# EAGLE design DIYmakey_v2 (EAGLE 9.6.2)
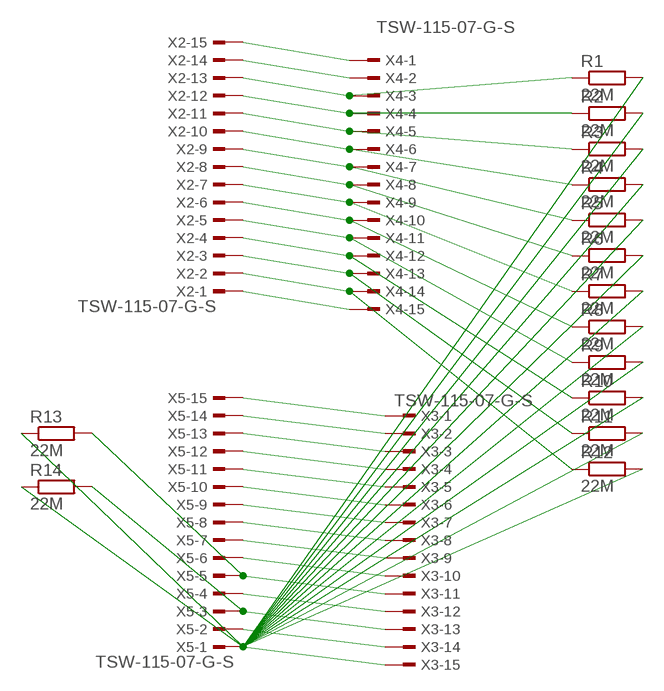
[diagram p0: schematic, sheet 1]

## Parts
R1  22M  R-EU_0207/7  [0207/7]
R2  22M  R-EU_0207/7  [0207/7]
R3  22M  R-EU_0207/7  [0207/7]
R4  22M  R-EU_0207/7  [0207/7]
R5  22M  R-EU_0207/7  [0207/7]
R6  22M  R-EU_0207/7  [0207/7]
R7  22M  R-EU_0207/7  [0207/7]
R8  22M  R-EU_0207/7  [0207/7]
R9  22M  R-EU_0207/7  [0207/7]
R10  22M  R-EU_0207/7  [0207/7]
R11  22M  R-EU_0207/7  [0207/7]
R12  22M  R-EU_0207/7  [0207/7]
R13  22M  R-EU_0207/7  [0207/7]
R14  22M  R-EU_0207/7  [0207/7]
X2  TSW-115-07-G-S  [TSW-115-XX-G-S]
X3  TSW-115-07-G-S  [TSW-115-XX-G-S]
X4  TSW-115-07-G-S  [TSW-115-XX-G-S]
X5  TSW-115-07-G-S  [TSW-115-XX-G-S]

## Nets
N$1: X2.15 X4.1
N$2: X2.14 X4.2
N$3: R1.1 X2.13 X4.3
N$4: R2.1 X2.12 X4.4
N$5: R3.1 X2.11 X4.5
N$6: R4.1 X2.10 X4.6
N$7: R5.1 X2.9 X4.7
N$8: R6.1 X2.8 X4.8
N$9: R7.1 X2.7 X4.9
N$10: R8.1 X2.6 X4.10
N$11: R9.1 X2.5 X4.11
N$12: R10.1 X2.4 X4.12
N$13: R11.1 X2.3 X4.13
N$14: R12.1 X2.2 X4.14
N$15: X2.1 X4.15
N$16: X3.1 X5.15
N$17: X3.2 X5.14
N$18: X3.3 X5.13
N$19: X3.4 X5.12
N$20: X3.5 X5.11
N$21: X3.6 X5.10
N$22: X3.7 X5.9
N$23: X3.8 X5.8
N$24: X3.9 X5.7
N$25: X3.10 X5.6
N$26: R13.2 X3.11 X5.5
N$27: X3.12 X5.4
N$28: R14.2 X3.13 X5.3
N$29: X3.14 X5.2
N$30: R1.2 R2.2 R3.2 R4.2 R5.2 R6.2 R7.2 R8.2 R9.2 R10.2 R11.2 R12.2 R13.1 R14.1 X3.15 X5.1

## Library data of the parts
R1-R14 = rcl:R-EU_: RESISTOR, European symbol; SPICEPREFIX: R
X2-X5 = con-samtec:TSW-115-*-G-S: THROUGH-HOLE .025" SQ POST HEADER Source: Samtec TSW.pdf; MF: Samtec Inc.; MPN: TSW-115-07-G-S

## Board
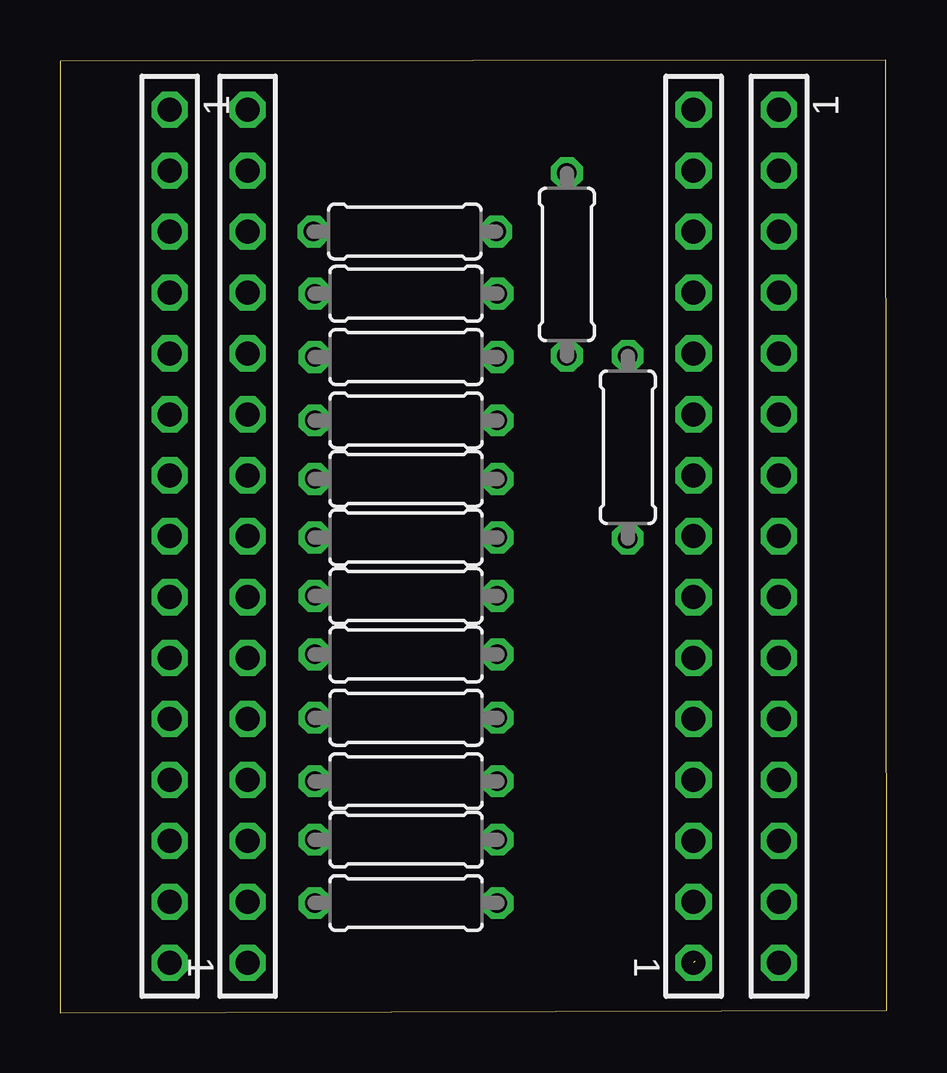
[diagram p1: board, top side]
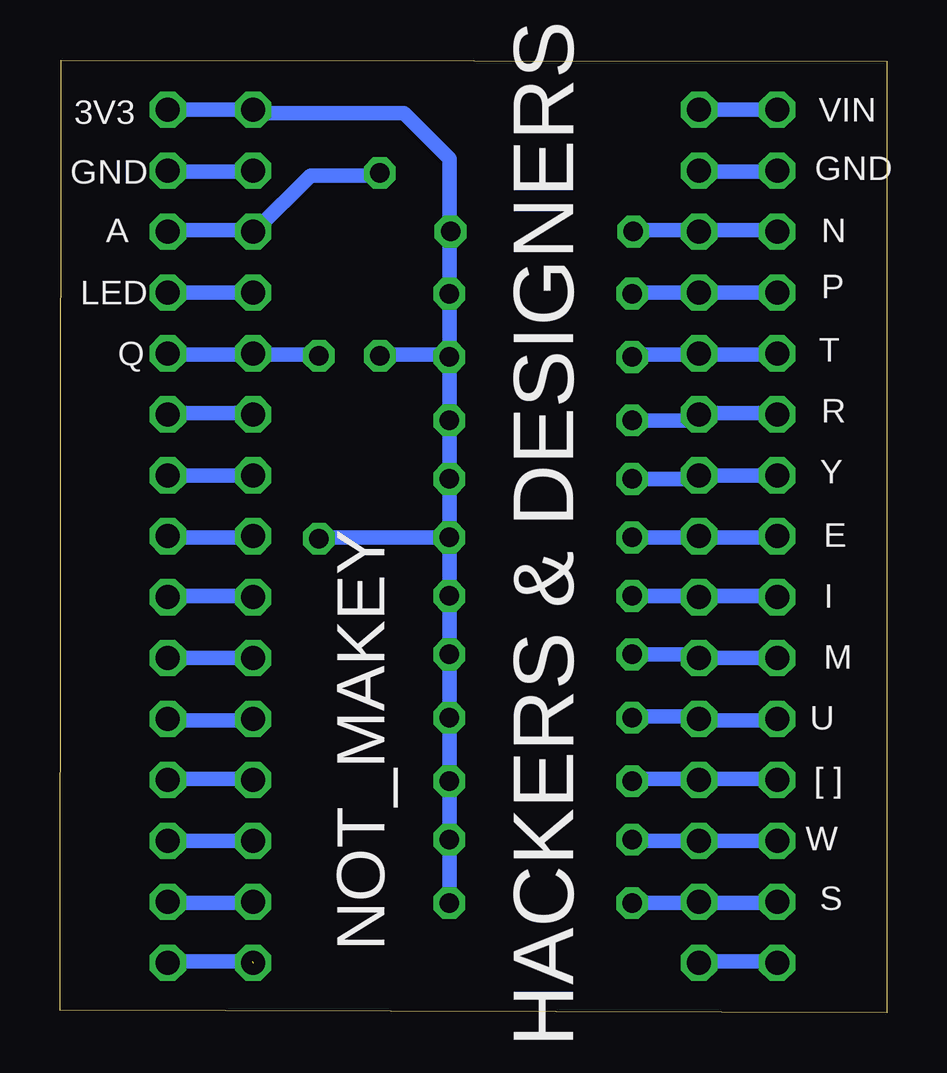
[diagram p2: board, bottom side, seen from below]

Size 34.47 x 39.72 mm. Coordinates in mm from the lower left corner, seen from the top.
Outline: 0,0 34.47,0.1 34.42,39.72 0,39.66 0,0
Copper layers (1*16): Top 0.035mm / dielectric 1.5mm / Bottom 0.035mm
Design rules "default": minimum track width 6mil, minimum drill 0.35mm, track to track 6mil, track to pad 6mil, pad to pad 6mil, via to via 6mil, smd to smd 6mil, copper to edge 40mil, drill to drill 6mil, minimum pad ring 10mil, minimum via ring 8mil, stop-mask expansion 4mil, vias tented up to drill 0mil, thermal gap 10mil

### Footprints (pad centres in the part's own frame; a part is rotated, then mirrored left to right if it is on the bottom)
0207/7 = drill 0.813 octagon: 1 -3.81,0; 2 3.81,0
TSW-115-XX-G-S = drill 1 pad 1.5 octagon: 1 17.78,0; 2 15.24,0; 3 12.7,0; 4 10.16,0; 5 7.62,0; 6 5.08,0; 7 2.54,0; 8 0,0; 9 -2.54,0; 10 -5.08,0; 11 -7.62,0; 12 -10.16,0; 13 -12.7,0; 14 -15.24,0; 15 -17.78,0

### Placement (x,y rotation side)
R1  14.38,32.56 0 top
R2  14.43,29.97 0 top
R3  14.43,27.33 0 top
R4  14.43,24.69 0 top
R5  14.43,22.25 0 top
R6  14.43,19.81 0 top
R7  14.43,17.37 0 top
R8  14.43,14.94 0 top
R9  14.43,12.29 0 top
R10  14.43,9.65 0 top
R11  14.43,7.21 0 top
R12  14.43,4.57 0 top
R13  23.67,23.57 90 top
R14  21.13,31.19 90 top
X2  7.82,19.86 270 top
X3  26.42,19.86 270 top
X4  4.57,19.86 90 top
X5  29.97,19.86 90 top

### Tracks (layer width: path | path; a pad name or v marks a point on that pad's centre or on a via)
N$1
  Bottom 0.61: X2.15 X4.1
N$2
  Bottom 0.152: 4.67,35.05 X4.2 | 7.72,35.05 X2.14
  Bottom 0.61: 7.72,35.05 4.67,35.05
N$3
  Bottom 0.152: 10.47,32.61 R1.1 | 7.87,32.61 X2.13 7.72,32.61 | 4.67,32.61 X4.3
  Bottom 0.61: 7.87,32.61 10.47,32.61 | 7.72,32.61 4.67,32.61
N$4
  Bottom 0.152: 10.62,30.02 R2.1
  Bottom 0.61: 10.62,30.02 X2.12 X4.4
N$5
  Bottom 0.152: 10.62,27.43 R3.1 | 7.87,27.43 X2.11 7.72,27.43 | 4.67,27.43 X4.5
  Bottom 0.61: 7.87,27.43 10.62,27.43 | 7.72,27.43 4.67,27.43
N$6
  Bottom 0.152: 8.03,24.69 7.87,24.84 X2.10 7.72,24.99 | 4.67,24.99 X4.6
  Bottom 0.61: 8.03,24.69 R4.1 | 7.72,24.99 4.67,24.99
N$7
  Bottom 0.152: 8.03,22.25 7.87,22.4 X2.9
  Bottom 0.61: 8.03,22.25 R5.1 | X2.9 X4.7
N$8
  Bottom 0.152: 7.87,19.81 X2.8 7.72,19.81 | 4.67,19.81 X4.8
  Bottom 0.61: 7.87,19.81 R6.1 | 7.72,19.81 4.67,19.81
N$9
  Bottom 0.152: 7.87,17.37 X2.7 7.72,17.37 | 4.67,17.37 X4.9
  Bottom 0.61: 7.87,17.37 R7.1 | 7.72,17.37 4.67,17.37
N$10
  Bottom 0.152: 8.03,14.93 7.87,14.78 X2.6
  Bottom 0.61: 8.03,14.93 R8.1 | X2.6 X4.10
N$11
  Bottom 0.152: 10.62,12.34 R9.1 | 7.87,12.34 X2.5 7.72,12.19 | 4.67,12.19 X4.11
  Bottom 0.61: 7.87,12.34 10.62,12.34 | 7.72,12.19 4.67,12.19
N$12
  Bottom 0.152: 10.62,9.75 R10.1 | 7.87,9.75 X2.4 7.72,9.75 | 4.67,9.75 X4.12
  Bottom 0.61: 7.87,9.75 10.62,9.75 | 7.72,9.75 4.67,9.75
N$13
  Bottom 0.152: 10.62,7.16 R11.1
  Bottom 0.61: 10.62,7.16 X2.3 X4.13
N$14
  Bottom 0.152: 7.87,4.57 X2.2 7.72,4.57 | 4.67,4.57 X4.14
  Bottom 0.61: 7.87,4.57 R12.1 | 7.72,4.57 4.67,4.57
N$15
  Bottom 0.152: 4.67,2.13 X4.15 | 7.72,2.13 X2.1
  Bottom 0.61: 7.72,2.13 4.67,2.13
N$16  (1 unrouted)
  Bottom 0.152: 29.97,2.13 X5.15
  Bottom 0.61: 29.97,2.13 26.47,2.13
N$17
  Bottom 0.152: 26.47,4.57 X3.2 | 29.97,4.57 X5.14
  Bottom 0.61: 29.97,4.57 26.47,4.57
N$18
  Bottom 0.61: X5.13 X3.3
N$19
  Bottom 0.152: 26.47,9.75 X3.4 | 29.97,9.75 X5.12
  Bottom 0.61: 29.97,9.75 26.47,9.75
N$20
  Bottom 0.152: 26.47,12.19 X3.5 | 29.97,12.19 X5.11
  Bottom 0.61: 29.97,12.19 26.47,12.19
N$21
  Bottom 0.61: X5.10 X3.6
N$22
  Bottom 0.152: 26.47,17.37 X3.7 | 29.97,17.37 X5.9
  Bottom 0.61: 29.97,17.37 26.47,17.37
N$23
  Bottom 0.152: 26.47,19.81 X3.8 | 29.97,19.81 X5.8
  Bottom 0.61: 29.97,19.81 26.47,19.81
N$24
  Bottom 0.61: X5.7 X3.9
N$25
  Bottom 0.152: 26.47,24.99 X3.10 | 29.97,24.99 X5.6
  Bottom 0.61: 29.97,24.99 26.47,24.99
N$26
  Bottom 0.152: 23.72,27.43 R13.2 | 26.31,27.43 X3.11 26.47,27.43 | 29.97,27.43 X5.5
  Bottom 0.61: 26.31,27.43 23.72,27.43 | 26.47,27.43 29.97,27.43
N$27
  Bottom 0.61: X5.4 X3.12
N$28
  Bottom 0.152: 21.13,34.9 R14.2 | 26.31,32.61 X3.13 26.47,32.61 | 29.97,32.61 X5.3
  Bottom 0.61: 21.13,34.9 24.03,34.9 26.31,32.61 | 26.47,32.61 29.97,32.61
N$29
  Bottom 0.152: 26.47,35.05 X3.14 | 29.97,35.05 X5.2
  Bottom 0.61: 29.97,35.05 26.47,35.05
N$30
  Bottom 0.152: 21.13,27.43 R14.1 | 18.24,27.43 R3.2 | 18.24,32.46 R1.2 18.24,32.61 | 26.16,37.49 X3.15 | 23.57,19.81 R13.1
  Bottom 0.61: X5.1 X3.15 | 21.13,27.43 18.24,27.43 R2.2 18.24,32.46 | 26.16,37.49 20.12,37.49 18.24,35.61 18.24,32.61 | R12.2 R11.2 R10.2 R9.2 R8.2 R7.2 R6.2 | R6.2 R5.2 R4.2 R3.2 | R6.2 23.57,19.81

### Text on the board
bPlace: VIN | 3V3 | GND | GND | N | A | P | LED | T | Q | R | Y | HACKERS & DESIGNERS | E | I | M | U | [ ] | W | S | NOT_MAKEY